# EAGLE schematic LOGO_WS2812 (EAGLE 9.6.2)
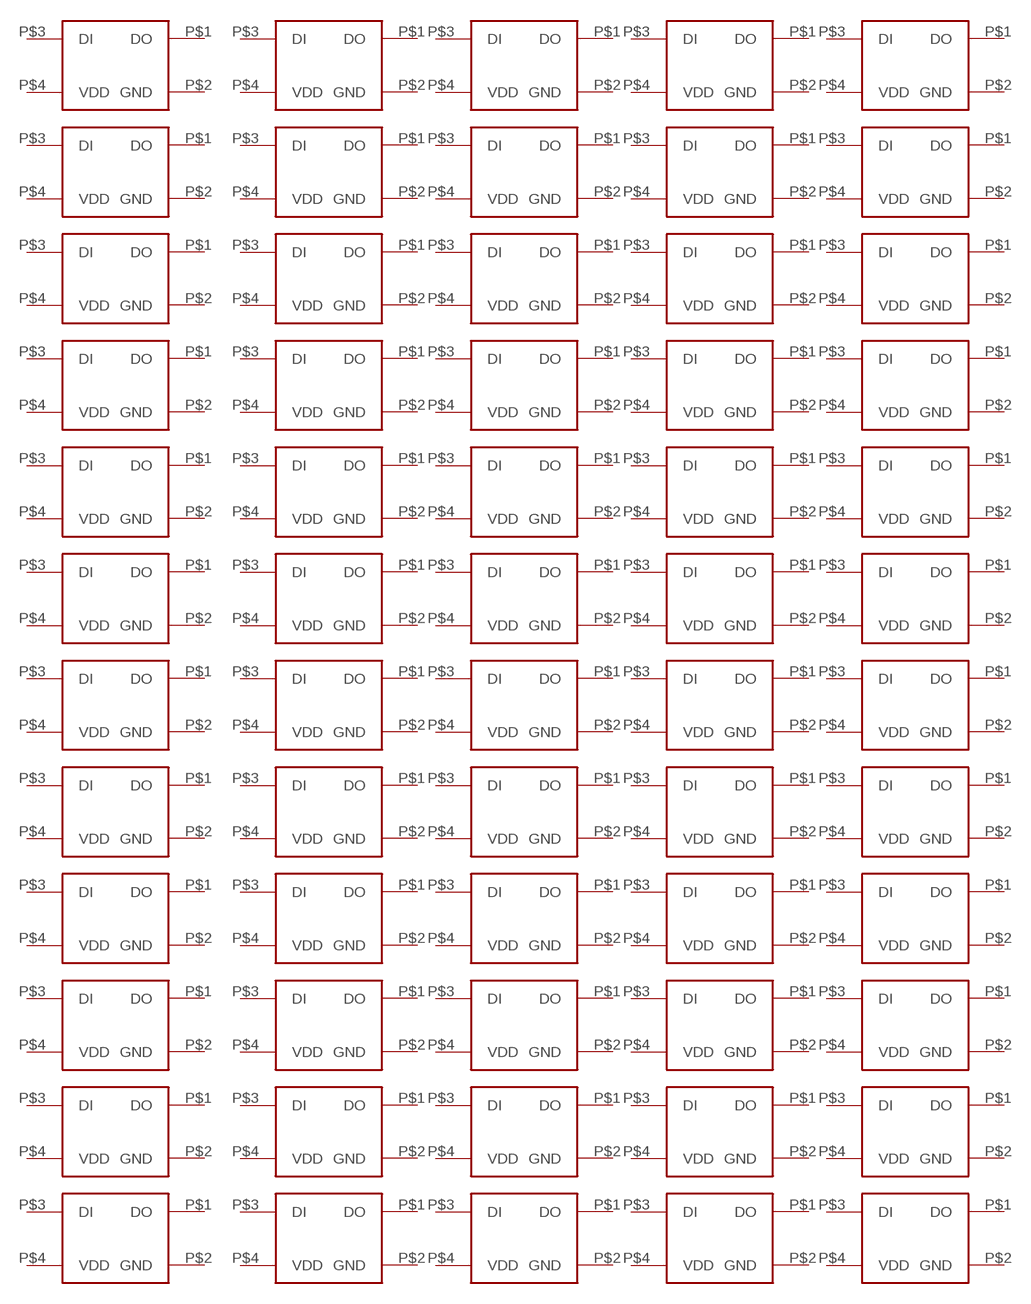
[diagram p0: schematic, sheet 1]

## Parts
U$1  WS2812  [WS2812]
U$2  WS2812  [WS2812]
U$3  WS2812  [WS2812]
U$4  WS2812  [WS2812]
U$5  WS2812  [WS2812]
U$6  WS2812  [WS2812]
U$7  WS2812  [WS2812]
U$8  WS2812  [WS2812]
U$9  WS2812  [WS2812]
U$10  WS2812  [WS2812]
U$11  WS2812  [WS2812]
U$12  WS2812  [WS2812]
U$13  WS2812  [WS2812]
U$14  WS2812  [WS2812]
U$15  WS2812  [WS2812]
U$16  WS2812  [WS2812]
U$17  WS2812  [WS2812]
U$18  WS2812  [WS2812]
U$19  WS2812  [WS2812]
U$20  WS2812  [WS2812]
U$21  WS2812  [WS2812]
U$22  WS2812  [WS2812]
U$23  WS2812  [WS2812]
U$24  WS2812  [WS2812]
U$25  WS2812  [WS2812]
U$26  WS2812  [WS2812]
U$27  WS2812  [WS2812]
U$28  WS2812  [WS2812]
U$29  WS2812  [WS2812]
U$30  WS2812  [WS2812]
U$31  WS2812  [WS2812]
U$32  WS2812  [WS2812]
U$33  WS2812  [WS2812]
U$34  WS2812  [WS2812]
U$35  WS2812  [WS2812]
U$36  WS2812  [WS2812]
U$37  WS2812  [WS2812]
U$38  WS2812  [WS2812]
U$39  WS2812  [WS2812]
U$40  WS2812  [WS2812]
U$41  WS2812  [WS2812]
U$42  WS2812  [WS2812]
U$43  WS2812  [WS2812]
U$44  WS2812  [WS2812]
U$45  WS2812  [WS2812]
U$46  WS2812  [WS2812]
U$47  WS2812  [WS2812]
U$48  WS2812  [WS2812]
U$49  WS2812  [WS2812]
U$50  WS2812  [WS2812]
U$51  WS2812  [WS2812]
U$52  WS2812  [WS2812]
U$53  WS2812  [WS2812]
U$54  WS2812  [WS2812]
U$55  WS2812  [WS2812]
U$56  WS2812  [WS2812]
U$57  WS2812  [WS2812]
U$58  WS2812  [WS2812]
U$59  WS2812  [WS2812]
U$60  WS2812  [WS2812]
Unconnected: U$1.P$1(DO) U$1.P$2(GND) U$1.P$3(DI) U$1.P$4(VDD) U$2.P$1(DO) U$2.P$2(GND) U$2.P$3(DI) U$2.P$4(VDD) U$3.P$1(DO) U$3.P$2(GND) U$3.P$3(DI) U$3.P$4(VDD) U$4.P$1(DO) U$4.P$2(GND) U$4.P$3(DI) U$4.P$4(VDD) U$5.P$1(DO) U$5.P$2(GND) U$5.P$3(DI) U$5.P$4(VDD) U$6.P$1(DO) U$6.P$2(GND) U$6.P$3(DI) U$6.P$4(VDD) U$7.P$1(DO) U$7.P$2(GND) U$7.P$3(DI) U$7.P$4(VDD) U$8.P$1(DO) U$8.P$2(GND) U$8.P$3(DI) U$8.P$4(VDD) U$9.P$1(DO) U$9.P$2(GND) U$9.P$3(DI) U$9.P$4(VDD) U$10.P$1(DO) U$10.P$2(GND) U$10.P$3(DI) U$10.P$4(VDD) U$11.P$1(DO) U$11.P$2(GND) U$11.P$3(DI) U$11.P$4(VDD) U$12.P$1(DO) U$12.P$2(GND) U$12.P$3(DI) U$12.P$4(VDD) U$13.P$1(DO) U$13.P$2(GND) U$13.P$3(DI) U$13.P$4(VDD) U$14.P$1(DO) U$14.P$2(GND) U$14.P$3(DI) U$14.P$4(VDD) U$15.P$1(DO) U$15.P$2(GND) U$15.P$3(DI) U$15.P$4(VDD) U$16.P$1(DO) U$16.P$2(GND) U$16.P$3(DI) U$16.P$4(VDD) U$17.P$1(DO) U$17.P$2(GND) U$17.P$3(DI) U$17.P$4(VDD) U$18.P$1(DO) U$18.P$2(GND) U$18.P$3(DI) U$18.P$4(VDD) U$19.P$1(DO) U$19.P$2(GND) U$19.P$3(DI) U$19.P$4(VDD) U$20.P$1(DO) U$20.P$2(GND) U$20.P$3(DI) U$20.P$4(VDD) U$21.P$1(DO) U$21.P$2(GND) U$21.P$3(DI) U$21.P$4(VDD) U$22.P$1(DO) U$22.P$2(GND) U$22.P$3(DI) U$22.P$4(VDD) U$23.P$1(DO) U$23.P$2(GND) U$23.P$3(DI) U$23.P$4(VDD) U$24.P$1(DO) U$24.P$2(GND) U$24.P$3(DI) U$24.P$4(VDD) U$25.P$1(DO) U$25.P$2(GND) U$25.P$3(DI) U$25.P$4(VDD) U$26.P$1(DO) U$26.P$2(GND) U$26.P$3(DI) U$26.P$4(VDD) U$27.P$1(DO) U$27.P$2(GND) U$27.P$3(DI) U$27.P$4(VDD) U$28.P$1(DO) U$28.P$2(GND) U$28.P$3(DI) U$28.P$4(VDD) U$29.P$1(DO) U$29.P$2(GND) U$29.P$3(DI) U$29.P$4(VDD) U$30.P$1(DO) U$30.P$2(GND) U$30.P$3(DI) U$30.P$4(VDD) U$31.P$1(DO) U$31.P$2(GND) U$31.P$3(DI) U$31.P$4(VDD) U$32.P$1(DO) U$32.P$2(GND) U$32.P$3(DI) U$32.P$4(VDD) U$33.P$1(DO) U$33.P$2(GND) U$33.P$3(DI) U$33.P$4(VDD) U$34.P$1(DO) U$34.P$2(GND) U$34.P$3(DI) U$34.P$4(VDD) U$35.P$1(DO) U$35.P$2(GND) U$35.P$3(DI) U$35.P$4(VDD) U$36.P$1(DO) U$36.P$2(GND) U$36.P$3(DI) U$36.P$4(VDD) U$37.P$1(DO) U$37.P$2(GND) U$37.P$3(DI) U$37.P$4(VDD) U$38.P$1(DO) U$38.P$2(GND) U$38.P$3(DI) U$38.P$4(VDD) U$39.P$1(DO) U$39.P$2(GND) U$39.P$3(DI) U$39.P$4(VDD) U$40.P$1(DO) U$40.P$2(GND) U$40.P$3(DI) U$40.P$4(VDD) U$41.P$1(DO) U$41.P$2(GND) U$41.P$3(DI) U$41.P$4(VDD) U$42.P$1(DO) U$42.P$2(GND) U$42.P$3(DI) U$42.P$4(VDD) U$43.P$1(DO) U$43.P$2(GND) U$43.P$3(DI) U$43.P$4(VDD) U$44.P$1(DO) U$44.P$2(GND) U$44.P$3(DI) U$44.P$4(VDD) U$45.P$1(DO) U$45.P$2(GND) U$45.P$3(DI) U$45.P$4(VDD) U$46.P$1(DO) U$46.P$2(GND) U$46.P$3(DI) U$46.P$4(VDD) U$47.P$1(DO) U$47.P$2(GND) U$47.P$3(DI) U$47.P$4(VDD) U$48.P$1(DO) U$48.P$2(GND) U$48.P$3(DI) U$48.P$4(VDD) U$49.P$1(DO) U$49.P$2(GND) U$49.P$3(DI) U$49.P$4(VDD) U$50.P$1(DO) U$50.P$2(GND) U$50.P$3(DI) U$50.P$4(VDD) U$51.P$1(DO) U$51.P$2(GND) U$51.P$3(DI) U$51.P$4(VDD) U$52.P$1(DO) U$52.P$2(GND) U$52.P$3(DI) U$52.P$4(VDD) U$53.P$1(DO) U$53.P$2(GND) U$53.P$3(DI) U$53.P$4(VDD) U$54.P$1(DO) U$54.P$2(GND) U$54.P$3(DI) U$54.P$4(VDD) U$55.P$1(DO) U$55.P$2(GND) U$55.P$3(DI) U$55.P$4(VDD) U$56.P$1(DO) U$56.P$2(GND) U$56.P$3(DI) U$56.P$4(VDD) U$57.P$1(DO) U$57.P$2(GND) U$57.P$3(DI) U$57.P$4(VDD) U$58.P$1(DO) U$58.P$2(GND) U$58.P$3(DI) U$58.P$4(VDD) U$59.P$1(DO) U$59.P$2(GND) U$59.P$3(DI) U$59.P$4(VDD) U$60.P$1(DO) U$60.P$2(GND) U$60.P$3(DI) U$60.P$4(VDD)

## Library data of the parts
U$1-U$60 = active components:WS2812